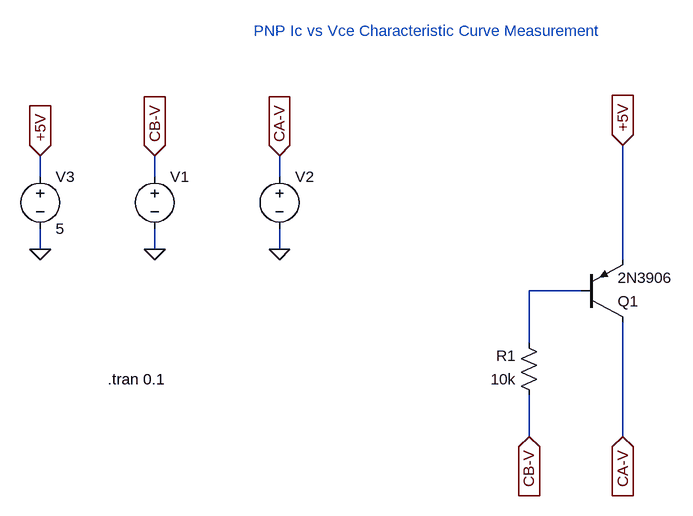
[diagram p0: schematic pnp_char_curve_ltspice.asc]
pnp_char_curve_ltspice.asc, the LTspice schematic file:
Version 4
SHEET 1 2932 680
WIRE -592 -80 -592 -112
WIRE -416 -80 -416 -112
WIRE -224 -80 -224 -112
WIRE -592 32 -592 0
WIRE -416 32 -416 0
WIRE -224 32 -224 0
WIRE 304 48 304 -128
WIRE 240 96 160 96
WIRE 160 176 160 96
WIRE 160 320 160 256
WIRE 304 320 304 144
FLAG 160 320 CB-V
IOPIN 160 320 In
FLAG 304 -128 +5V
IOPIN 304 -128 In
FLAG -416 32 0
FLAG -224 32 0
FLAG -416 -112 CB-V
IOPIN -416 -112 In
FLAG -224 -112 CA-V
IOPIN -224 -112 In
FLAG 304 320 CA-V
IOPIN 304 320 In
FLAG -592 32 0
FLAG -592 -112 +5V
IOPIN -592 -112 In
SYMBOL res 176 272 R180
WINDOW 0 36 76 Left 2
WINDOW 3 36 40 Left 2
SYMATTR InstName R1
SYMATTR Value 10k
SYMBOL voltage -416 -96 R0
WINDOW 3 24 44 Invisible 2
WINDOW 123 0 0 Left 0
WINDOW 39 0 0 Left 0
SYMATTR InstName V1
SYMATTR Value PWL REPEAT FOREVER(0 4.4 5m 4.4 5.0001m 4 10m 4 10.0001m 3.6 15m 3.6 15.0001m 3.2 20m 3.2 20.0001m 2.8 25m 2.8 25.0001m 2.4 30m 2.4 30.0001m 2 35m 2 35.0001m 1.6 40m 1.6 40.0001m 1.2 45m 1.2 45.0001m 0.8 50m 0.8 50.0001m 0.4 55m 0.4 55.0001m 4.4) ENDREPEAT
SYMBOL voltage -224 -96 R0
WINDOW 3 24 96 Invisible 2
SYMATTR InstName V2
SYMATTR Value PWL REPEAT FOREVER(0 2.5 1.25m 5 2.5m 2.5 3.75m 0 5m 2.5) ENDREPEAT
SYMBOL pnp 240 144 M180
SYMATTR InstName Q1
SYMATTR Value 2N3906
SYMBOL voltage -592 -96 R0
WINDOW 123 0 0 Left 0
WINDOW 39 0 0 Left 0
SYMATTR InstName V3
SYMATTR Value 5
TEXT -488 232 Left 2 !.tran 0.1
TEXT -264 -304 Left 2 ;PNP Ic vs Vce Characteristic Curve Measurement

The netlist it stands for:
* pnp_char_curve_ltspice.asc
R1 CB-V N001 10k
V1 CB-V 0 PWL REPEAT FOREVER(0 4.4 5m 4.4 5.0001m 4 10m 4 10.0001m 3.6 15m 3.6 15.0001m 3.2 20m 3.2 20.0001m 2.8 25m 2.8 25.0001m 2.4 30m 2.4 30.0001m 2 35m 2 35.0001m 1.6 40m 1.6 40.0001m 1.2 45m 1.2 45.0001m 0.8 50m 0.8 50.0001m 0.4 55m 0.4 55.0001m 4.4) ENDREPEAT
V2 CA-V 0 PWL REPEAT FOREVER(0 2.5 1.25m 5 2.5m 2.5 3.75m 0 5m 2.5) ENDREPEAT
Q1 CA-V N001 +5V 0 2N3906
V3 +5V 0 5
.model NPN NPN
.model PNP PNP
.lib standard.bjt
.tran 0.1
* PNP Ic vs Vce Characteristic Curve Measurement
.backanno
.end